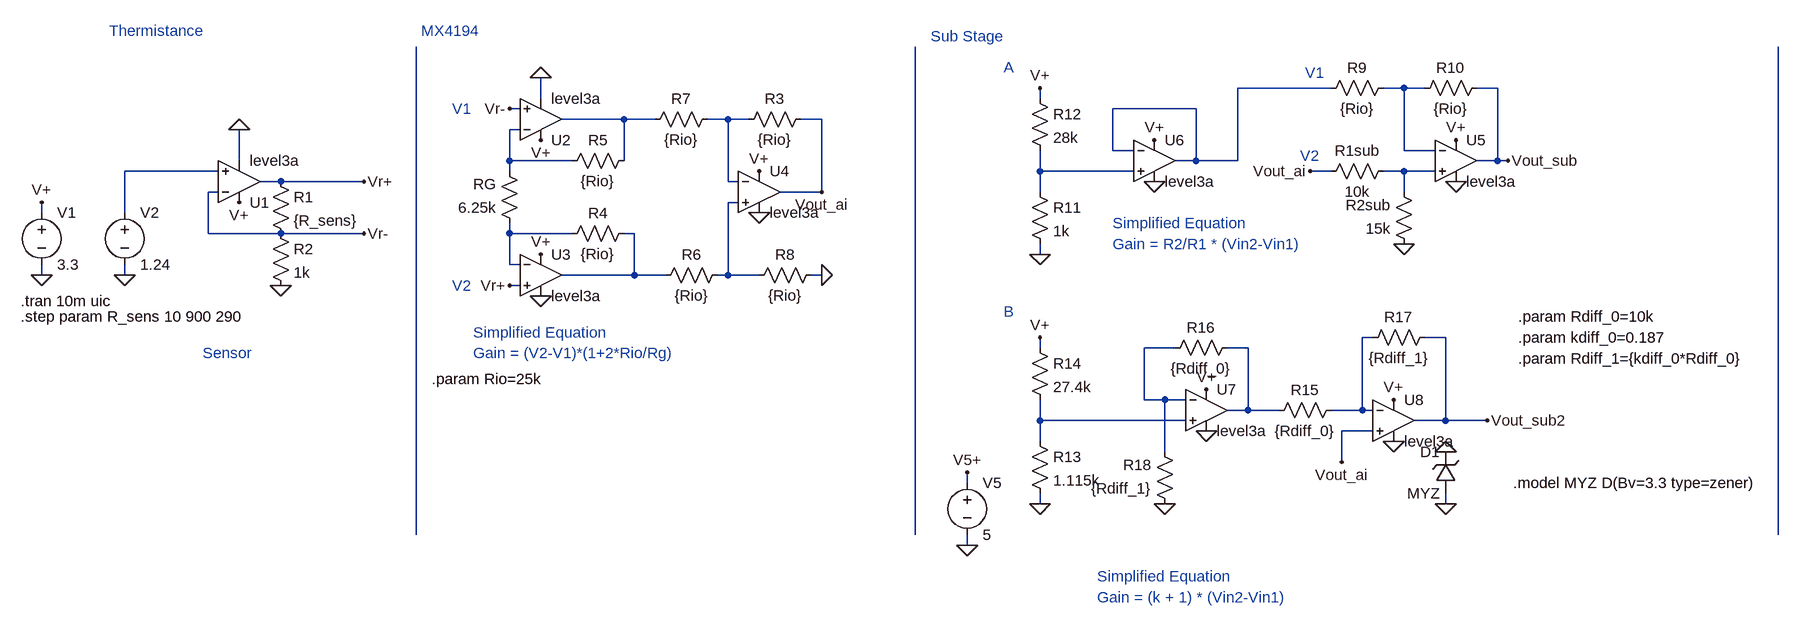
[diagram p0: schematic Resitive.asc]
Resitive.asc, the LTspice schematic file:
Version 4
SHEET 1 4952 816
WIRE 1936 16 1792 16
WIRE 2048 16 2016 16
WIRE 2080 16 2048 16
WIRE 2192 16 2160 16
WIRE 720 32 720 0
WIRE 1488 32 1488 16
WIRE 688 48 672 48
WIRE 1728 48 1600 48
WIRE 848 64 752 64
WIRE 896 64 848 64
WIRE 1008 64 976 64
WIRE 1040 64 1008 64
WIRE 1152 64 1120 64
WIRE 688 80 672 80
WIRE 1600 112 1600 48
WIRE 1632 112 1600 112
WIRE 2048 112 2048 16
WIRE 2096 112 2048 112
WIRE 256 128 256 80
WIRE 672 128 672 80
WIRE 768 128 672 128
WIRE 848 128 848 64
WIRE 1728 128 1728 48
WIRE 1728 128 1696 128
WIRE 1792 128 1792 16
WIRE 1792 128 1728 128
WIRE 2192 128 2192 16
WIRE 2192 128 2160 128
WIRE 2208 128 2192 128
WIRE 224 144 80 144
WIRE 672 144 672 128
WIRE 1488 144 1488 112
WIRE 1632 144 1488 144
WIRE 1936 144 1904 144
WIRE 2048 144 2016 144
WIRE 2096 144 2048 144
WIRE 320 160 288 160
WIRE 448 160 320 160
WIRE 1008 160 1008 64
WIRE 1024 160 1008 160
WIRE 224 176 208 176
WIRE 1152 176 1152 64
WIRE 1152 176 1088 176
WIRE 1488 176 1488 144
WIRE 2048 176 2048 144
WIRE 1024 192 1008 192
WIRE -48 208 -48 192
WIRE 80 208 80 144
WIRE 208 240 208 176
WIRE 320 240 208 240
WIRE 448 240 320 240
WIRE 672 240 672 224
WIRE 768 240 672 240
WIRE 864 240 848 240
WIRE 1488 272 1488 256
WIRE 672 288 672 240
WIRE 688 288 672 288
WIRE -48 304 -48 288
WIRE 80 304 80 288
WIRE 864 304 864 240
WIRE 864 304 752 304
WIRE 912 304 864 304
WIRE 1008 304 1008 192
WIRE 1008 304 992 304
WIRE 1056 304 1008 304
WIRE 1152 304 1136 304
WIRE 688 320 672 320
WIRE 2000 400 1984 400
WIRE 2112 400 2080 400
WIRE 1488 416 1488 400
WIRE 1696 416 1648 416
WIRE 1808 416 1776 416
WIRE 1648 496 1648 416
WIRE 1680 496 1648 496
WIRE 1712 496 1680 496
WIRE 1808 512 1808 416
WIRE 1808 512 1776 512
WIRE 1856 512 1808 512
WIRE 1984 512 1984 400
WIRE 1984 512 1936 512
WIRE 2000 512 1984 512
WIRE 1488 528 1488 496
WIRE 1712 528 1488 528
WIRE 2112 528 2112 400
WIRE 2112 528 2064 528
WIRE 2176 528 2112 528
WIRE 2000 544 1952 544
WIRE 1488 560 1488 528
WIRE 1680 576 1680 496
WIRE 1952 592 1952 544
WIRE 1376 624 1376 608
WIRE 1488 656 1488 640
WIRE 2112 656 2112 640
WIRE 528 704 528 -48
WIRE 1296 704 1296 -48
WIRE 2624 704 2624 -48
WIRE 1376 720 1376 704
FLAG -48 192 V+
FLAG -48 304 0
FLAG 256 80 0
FLAG 256 192 V+
FLAG 80 304 0
FLAG 320 320 0
FLAG 720 336 0
FLAG 720 0 0
FLAG 720 272 V+
FLAG 720 96 V+
FLAG 1056 144 V+
FLAG 1056 208 0
FLAG 448 160 Vr+
FLAG 448 240 Vr-
FLAG 672 48 Vr-
FLAG 672 320 Vr+
FLAG 1152 304 0
FLAG 1152 176 Vout_ai
FLAG 1904 144 Vout_ai
FLAG 2128 96 V+
FLAG 2128 160 0
FLAG 2048 256 0
FLAG 1488 272 0
FLAG 2208 128 Vout_sub
FLAG 1488 16 V+
FLAG 1664 160 0
FLAG 1664 96 V+
FLAG 1744 544 0
FLAG 1744 480 V+
FLAG 2032 560 0
FLAG 2032 496 V+
FLAG 1488 656 0
FLAG 1488 400 V+
FLAG 1952 592 Vout_ai
FLAG 2176 528 Vout_sub2
FLAG 1680 656 0
FLAG 2112 656 0
FLAG 2112 576 0
FLAG 1376 608 V5+
FLAG 1376 720 0
SYMBOL OpAmps\\UniversalOpAmp3 256 160 M180
SYMATTR InstName U1
SYMBOL voltage -48 192 R0
WINDOW 123 0 0 Left 0
WINDOW 39 0 0 Left 0
SYMATTR InstName V1
SYMATTR Value 3.3
SYMBOL voltage 80 192 R0
WINDOW 123 0 0 Left 0
WINDOW 39 0 0 Left 0
SYMATTR InstName V2
SYMATTR Value 1.24
SYMBOL res 304 144 R0
SYMATTR InstName R1
SYMATTR Value {R_sens}
SYMBOL res 304 224 R0
SYMATTR InstName R2
SYMATTR Value 1k
SYMBOL res 688 240 R180
WINDOW 0 36 76 Left 2
WINDOW 3 36 40 Left 2
SYMATTR InstName RG
SYMATTR Value 6.25k
SYMBOL OpAmps\\UniversalOpAmp3 720 64 M180
SYMATTR InstName U2
SYMBOL OpAmps\\UniversalOpAmp3 720 304 R0
SYMATTR InstName U3
SYMBOL res 864 224 R90
WINDOW 0 0 56 VBottom 2
WINDOW 3 32 56 VTop 2
SYMATTR InstName R4
SYMATTR Value {Rio}
SYMBOL res 864 112 R90
WINDOW 0 0 56 VBottom 2
WINDOW 3 32 56 VTop 2
SYMATTR InstName R5
SYMATTR Value {Rio}
SYMBOL res 1008 288 R90
WINDOW 0 0 56 VBottom 2
WINDOW 3 32 56 VTop 2
SYMATTR InstName R6
SYMATTR Value {Rio}
SYMBOL res 992 48 R90
WINDOW 0 0 56 VBottom 2
WINDOW 3 32 56 VTop 2
SYMATTR InstName R7
SYMATTR Value {Rio}
SYMBOL OpAmps\\UniversalOpAmp3 1056 176 R0
SYMATTR InstName U4
SYMBOL res 1152 288 R90
WINDOW 0 0 56 VBottom 2
WINDOW 3 32 56 VTop 2
SYMATTR InstName R8
SYMATTR Value {Rio}
SYMBOL res 1136 48 R90
WINDOW 0 0 56 VBottom 2
WINDOW 3 32 56 VTop 2
SYMATTR InstName R3
SYMATTR Value {Rio}
SYMBOL OpAmps\\UniversalOpAmp3 2128 128 R0
SYMATTR InstName U5
SYMBOL res 2032 0 R90
WINDOW 0 0 56 VBottom 2
WINDOW 3 32 56 VTop 2
SYMATTR InstName R9
SYMATTR Value {Rio}
SYMBOL res 2176 0 R90
WINDOW 0 0 56 VBottom 2
WINDOW 3 32 56 VTop 2
SYMATTR InstName R10
SYMATTR Value {Rio}
SYMBOL res 2032 128 R90
WINDOW 0 0 56 VBottom 2
WINDOW 3 32 56 VTop 2
SYMATTR InstName R1sub
SYMATTR Value 10k
SYMBOL res 2064 272 R180
WINDOW 0 36 76 Left 2
WINDOW 3 36 40 Left 2
SYMATTR InstName R2sub
SYMATTR Value 15k
SYMBOL res 1472 160 R0
SYMATTR InstName R11
SYMATTR Value 1k
SYMBOL res 1472 16 R0
SYMATTR InstName R12
SYMATTR Value 28k
SYMBOL OpAmps\\UniversalOpAmp3 1664 128 R0
SYMATTR InstName U6
SYMBOL OpAmps\\UniversalOpAmp3 1744 512 R0
SYMATTR InstName U7
SYMBOL OpAmps\\UniversalOpAmp3 2032 528 R0
SYMATTR InstName U8
SYMBOL res 1472 544 R0
SYMATTR InstName R13
SYMATTR Value 1.115k
SYMBOL res 1472 400 R0
SYMATTR InstName R14
SYMATTR Value 27.4k
SYMBOL res 1952 496 R90
WINDOW 0 0 56 VBottom 2
WINDOW 3 32 56 VTop 2
SYMATTR InstName R15
SYMATTR Value {Rdiff_0}
SYMBOL res 1792 400 R90
WINDOW 0 0 56 VBottom 2
WINDOW 3 32 56 VTop 2
SYMATTR InstName R16
SYMATTR Value {Rdiff_0}
SYMBOL res 2096 384 R90
WINDOW 0 0 56 VBottom 2
WINDOW 3 32 56 VTop 2
SYMATTR InstName R17
SYMATTR Value {Rdiff_1}
SYMBOL res 1696 672 R180
WINDOW 0 36 76 Left 2
WINDOW 3 36 40 Left 2
SYMATTR InstName R18
SYMATTR Value {Rdiff_1}
SYMBOL zener 2128 640 R180
WINDOW 0 24 64 Left 2
WINDOW 3 24 0 Left 2
SYMATTR InstName D1
SYMATTR Value MYZ
SYMBOL voltage 1376 608 R0
WINDOW 123 0 0 Left 0
WINDOW 39 0 0 Left 0
SYMATTR InstName V5
SYMATTR Value 5
TEXT -80 344 Left 2 !.tran 10m uic
TEXT 552 464 Left 2 !.param Rio=25k
TEXT -80 368 Left 2 !.step param R_sens 10 900 290
TEXT 616 424 Left 2 ;Gain = (V2-V1)*(1+2*Rio/Rg)
TEXT 616 392 Left 2 ;Simplified Equation
TEXT 1600 224 Left 2 ;Simplified Equation
TEXT 1600 256 Left 2 ;Gain = R2/R1 * (Vin2-Vin1)
TEXT 584 48 Left 2 ;V1
TEXT 584 320 Left 2 ;V2
TEXT 1888 120 Left 2 ;V2
TEXT 1896 -8 Left 2 ;V1
TEXT 2224 368 Left 2 !.param Rdiff_0=10k
TEXT 2224 400 Left 2 !.param kdiff_0=0.187
TEXT 2224 432 Left 2 !.param Rdiff_1={kdiff_0*Rdiff_0}
TEXT 1576 768 Left 2 ;Simplified Equation
TEXT 1576 800 Left 2 ;Gain = (k + 1) * (Vin2-Vin1)
TEXT 1432 -16 Left 2 ;A
TEXT 1432 360 Left 2 ;B
TEXT 200 424 Left 2 ;Sensor
TEXT 1320 -64 Left 2 ;Sub Stage
TEXT 536 -72 Left 2 ;MX4194
TEXT 56 -72 Left 2 ;Thermistance
TEXT 2216 624 Left 2 !.model MYZ D(Bv=3.3 type=zener)

The netlist it stands for:
* Resitive.asc
XU1 N006 Vr- V+ 0 Vr+ level3a  ; pins In+ In- V+ V- OUT
V1 V+ 0 3.3
V2 N006 0 1.24
R1 Vr+ Vr- {R_sens}
R2 Vr- 0 1k
RG N010 N005 6.25k
XU2 Vr- N005 V+ 0 N003 level3a  ; pins In+ In- V+ V- OUT
XU3 Vr+ N010 V+ 0 N011 level3a  ; pins In+ In- V+ V- OUT
R4 N011 N010 {Rio}
R5 N003 N005 {Rio}
R6 N009 N011 {Rio}
R7 N004 N003 {Rio}
XU4 N009 N004 V+ 0 Vout_ai level3a  ; pins In+ In- V+ V- OUT
R8 0 N009 {Rio}
R3 Vout_ai N004 {Rio}
XU5 N008 N002 V+ 0 Vout_sub level3a  ; pins In+ In- V+ V- OUT
R9 N002 N001 {Rio}
R10 Vout_sub N002 {Rio}
R1sub N008 Vout_ai 10k
R2sub 0 N008 15k
R11 N007 0 1k
R12 V+ N007 28k
XU6 N007 N001 V+ 0 N001 level3a  ; pins In+ In- V+ V- OUT
XU7 N015 N013 V+ 0 N014 level3a  ; pins In+ In- V+ V- OUT
XU8 Vout_ai N012 V+ 0 Vout_sub2 level3a  ; pins In+ In- V+ V- OUT
R13 N015 0 1.115k
R14 V+ N015 27.4k
R15 N012 N014 {Rdiff_0}
R16 N014 N013 {Rdiff_0}
R17 Vout_sub2 N012 {Rdiff_1}
R18 0 N013 {Rdiff_1}
D1 0 0 MYZ
V5 V5+ 0 5
.model D D
.lib standard.dio
.tran 10m uic
.param Rio=25k
.step param R_sens 10 900 290
* Gain = (V2-V1)*(1+2*Rio/Rg)
* Simplified Equation
* Simplified Equation
* Gain = R2/R1 * (Vin2-Vin1)
* V1
* V2
* V2
* V1
.param Rdiff_0=10k
.param kdiff_0=0.187
.param Rdiff_1={kdiff_0*Rdiff_0}
* Simplified Equation
* Gain = (k + 1) * (Vin2-Vin1)
* A
* B
* Sensor
* Sub Stage
* MX4194
* Thermistance
.model MYZ D(Bv=3.3 type=zener)
.backanno
.end